# EAGLE design Jubeat Controller_c (EAGLE 6.2)
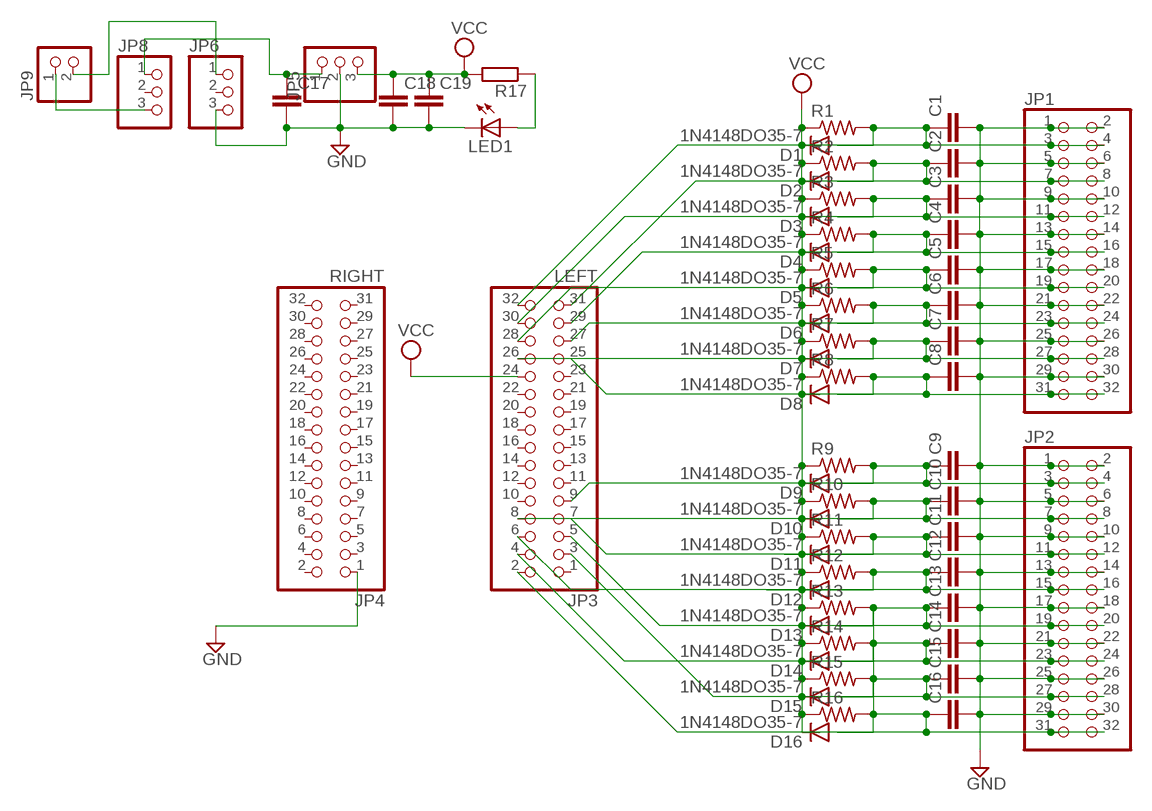
[diagram p0: schematic, sheet 1]

## Parts
C1  C-EU050-025X075  [C050-025X075]
C2  C-EU050-025X075  [C050-025X075]
C3  C-EU050-025X075  [C050-025X075]
C4  C-EU050-025X075  [C050-025X075]
C5  C-EU050-025X075  [C050-025X075]
C6  C-EU050-025X075  [C050-025X075]
C7  C-EU050-025X075  [C050-025X075]
C8  C-EU050-025X075  [C050-025X075]
C9  C-EU050-025X075  [C050-025X075]
C10  C-EU050-025X075  [C050-025X075]
C11  C-EU050-025X075  [C050-025X075]
C12  C-EU050-025X075  [C050-025X075]
C13  C-EU050-025X075  [C050-025X075]
C14  C-EU050-025X075  [C050-025X075]
C15  C-EU050-025X075  [C050-025X075]
C16  C-EU050-025X075  [C050-025X075]
C17  C-EU050-025X075  [C050-025X075]
C18  C-EU050-025X075  [C050-025X075]
C19  C-EU050-025X075  [C050-025X075]
D1  1N4148DO35-7  [DO35-7]
D2  1N4148DO35-7  [DO35-7]
D3  1N4148DO35-7  [DO35-7]
D4  1N4148DO35-7  [DO35-7]
D5  1N4148DO35-7  [DO35-7]
D6  1N4148DO35-7  [DO35-7]
D7  1N4148DO35-7  [DO35-7]
D8  1N4148DO35-7  [DO35-7]
D9  1N4148DO35-7  [DO35-7]
D10  1N4148DO35-7  [DO35-7]
D11  1N4148DO35-7  [DO35-7]
D12  1N4148DO35-7  [DO35-7]
D13  1N4148DO35-7  [DO35-7]
D14  1N4148DO35-7  [DO35-7]
D15  1N4148DO35-7  [DO35-7]
D16  1N4148DO35-7  [DO35-7]
JP1  PINHD-2X16  [2X16]
JP2  PINHD-2X16  [2X16]
JP3  LEFT  PINHD-2X16  [2X16]
JP4  RIGHT  PINHD-2X16  [2X16]
JP5  PINHD-1X3  [1X03]
JP6  PINHD-1X3  [1X03]
JP8  PINHD-1X3  [1X03]
JP9  PINHD-1X2  [1X02]
LED1  LED5MM  [LED5MM]
R1  R-US_0207/7  [0207/7]
R2  R-US_0207/7  [0207/7]
R3  R-US_0207/7  [0207/7]
R4  R-US_0207/7  [0207/7]
R5  R-US_0207/7  [0207/7]
R6  R-US_0207/7  [0207/7]
R7  R-US_0207/7  [0207/7]
R8  R-US_0207/7  [0207/7]
R9  R-US_0207/7  [0207/7]
R10  R-US_0207/7  [0207/7]
R11  R-US_0207/7  [0207/7]
R12  R-US_0207/7  [0207/7]
R13  R-US_0207/7  [0207/7]
R14  R-US_0207/7  [0207/7]
R15  R-US_0207/7  [0207/7]
R16  R-US_0207/7  [0207/7]
R17  R-EU_0207/7  [0207/7]

## Nets
GND: C1.2 C2.2 C3.2 C4.2 C5.2 C6.2 C7.2 C8.2 C9.2 C10.2 C11.2 C12.2 C13.2 C14.2 C15.2 C16.2 C17.2 C18.2 C19.2 JP1.1 JP1.2 JP1.5 JP1.6 JP1.9 JP1.10 JP1.13 JP1.14 JP1.17 JP1.18 JP1.21 JP1.22 JP1.25 JP1.26 JP1.29 JP1.30 JP2.1 JP2.2 JP2.5 JP2.6 JP2.9 JP2.10 JP2.13 JP2.14 JP2.17 JP2.18 JP2.21 JP2.22 JP2.25 JP2.26 JP2.29 JP2.30 JP4.1 JP5.2 JP6.3 LED1.K(C)
N$1: C17.1 JP5.1 JP8.1
N$2: C2.1 D2.A JP1.7 JP1.8 JP3.31 R2.2
N$5: JP6.1 JP9.2
N$6: C6.1 D6.A JP1.23 JP1.24 JP3.27 R6.2
N$7: LED1.A R17.1
N$8: C8.1 D8.A JP1.31 JP1.32 JP3.25 R8.2
N$9: C9.1 D9.A JP2.3 JP2.4 JP3.9 R9.2
N$10: C10.1 D10.A JP2.7 JP2.8 JP3.8 R10.2
N$11: C11.1 D11.A JP2.11 JP2.12 JP3.7 R11.2
N$12: C12.1 D12.A JP2.15 JP2.16 JP3.6 R12.2
N$13: C13.1 D13.A JP2.19 JP2.20 JP3.5 R13.2
N$14: C14.1 D14.A JP2.23 JP2.24 JP3.4 R14.2
N$15: C15.1 D15.A JP2.27 JP2.28 JP3.3 R15.2
N$16: C16.1 D16.A JP2.31 JP2.32 JP3.2 R16.2
N$18: C7.1 D7.A JP1.27 JP1.28 JP3.26 R7.2
N$19: JP8.3 JP9.1
N$21: C5.1 D5.A JP1.19 JP1.20 JP3.28 R5.2
N$23: C3.1 D3.A JP1.11 JP1.12 JP3.30 R3.2
N$24: C1.1 D1.A JP1.3 JP1.4 JP3.32 R1.2
N$26: C4.1 D4.A JP1.15 JP1.16 JP3.29 R4.2
VCC: C18.1 C19.1 D1.C D2.C D3.C D4.C D5.C D6.C D7.C D8.C D9.C D10.C D11.C D12.C D13.C D14.C D15.C D16.C JP3.24 JP5.3 R1.1 R2.1 R3.1 R4.1 R5.1 R6.1 R7.1 R8.1 R9.1 R10.1 R11.1 R12.1 R13.1 R14.1 R15.1 R16.1 R17.2
Unconnected: JP3.1 JP3.10 JP3.11 JP3.12 JP3.13 JP3.14 JP3.15 JP3.16 JP3.17 JP3.18 JP3.19 JP3.20 JP3.21 JP3.22 JP3.23 JP4.2 JP4.3 JP4.4 JP4.5 JP4.6 JP4.7 JP4.8 JP4.9 JP4.10 JP4.11 JP4.12 JP4.13 JP4.14 JP4.15 JP4.16 JP4.17 JP4.18 JP4.19 JP4.20 JP4.21 JP4.22 JP4.23 JP4.24 JP4.25 JP4.26 JP4.27 JP4.28 JP4.29 JP4.30 JP4.31 JP4.32 JP6.2 JP8.2

## Library data of the parts
C1-C16 = resistor:C-EU: CAPACITOR, European symbol
C17-C19 = rcl:C-EU: CAPACITOR, European symbol
D1-D16 = diode:1N4148: DIODE high speed (Philips)
JP1-JP4 = pinhead:PINHD-2X16: PIN HEADER
JP5 JP6 JP8 = pinhead:PINHD-1X3: PIN HEADER
JP9 = pinhead:PINHD-1X2: PIN HEADER
LED1 = led:LED: LED OSRAM: - CHIPLED LG R971, LG N971, LY N971, LG Q971, LY Q971, LO R971, LY R971 LH N974, LH R974 LS Q976, LO Q976, LY Q976 LO Q996 - Hyper CHIPLED LW Q18S LB Q993, LB Q99A, LB R99A - SideLED LS A670, LO A670, LY A670, LG A670, LP A670 LB A673, LV A673, LT A673, LW A673 LH A674 LY A675 LS A676, LA A676, LO A676, LY A676, LW A676 LS A679, LY A679, LG A679 - Hyper Micro SIDELED® LS Y876, LA Y876, LO Y876, LY Y876 LT Y87S - SmartLED LW L88C, LW L88S LB L89C, LB L89S, LG L890 LS L89K, LO L89K, LY L89K LS L896, LA L896, LO L896, LY L896 - TOPLED LS T670, LO T670, LY T670, LG T670, LP T670 LSG T670, LSP T670, LSY T670, LOP T670, LYG T670 LG T671, LOG T671, LSG T671 LB T673, LV T673, LT T673, LW T673 LH T674 LS T676, LA T676, LO T676, LY T676, LB T676, LH T676, LSB T676, LW T676 LB T67C, LV T67C, LT T67C, LS T67K, LO T67K, LY T67K, LW E67C LS E67B, LA E67B, LO E67B, LY E67B, LB E67C, LV E67C, LT E67C LW T67C LS T679, LY T679, LG T679 LS T770, LO T770, LY T770, LG T770, LP T770 LB T773, LV T773, LT T773, LW T773 LH T774 LS E675, LA E675, LY E675, LS T675 LS T776, LA T776, LO T776, LY T776, LB T776 LHGB T686 LT T68C, LB T68C - Hyper Mini TOPLED® LB M676 - Mini TOPLED Santana® LG M470 LS M47K, LO M47K, LY M47K Source: http://www.osram.convergy.de LUXEON: - LUMILED® LXK2-PW12-R00, LXK2-PW12-S00, LXK2-PW14-U00, LXK2-PW14-V00 LXK2-PM12-R00, LXK2-PM12-S00, LXK2-PM14-U00 LXK2-PE12-Q00, LXK2-PE12-R00, LXK2-PE12-S00, LXK2-PE14-T00, LXK2-PE14-U00 LXK2-PB12-K00, LXK2-PB12-L00, LXK2-PB12-M00, LXK2-PB14-N00, LXK2-PB14-P00, LXK2-PB14-Q00 LXK2-PR12-L00, LXK2-PR12-M00, LXK2-PR14-Q00, LXK2-PR14-R00 LXK2-PD12-Q00, LXK2-PD12-R00, LXK2-PD12-S00 LXK2-PH12-R00, LXK2-PH12-S00 LXK2-PL12-P00, LXK2-PL12-Q00, LXK2-PL12-R00 Source: www.luxeon.com KINGBRIGHT: KA-3528ASYC Source: www.kingbright.com
R1-R16 = resistor:R-US_: RESISTOR, American symbol
R17 = rcl:R-EU_: RESISTOR, European symbol

## Board
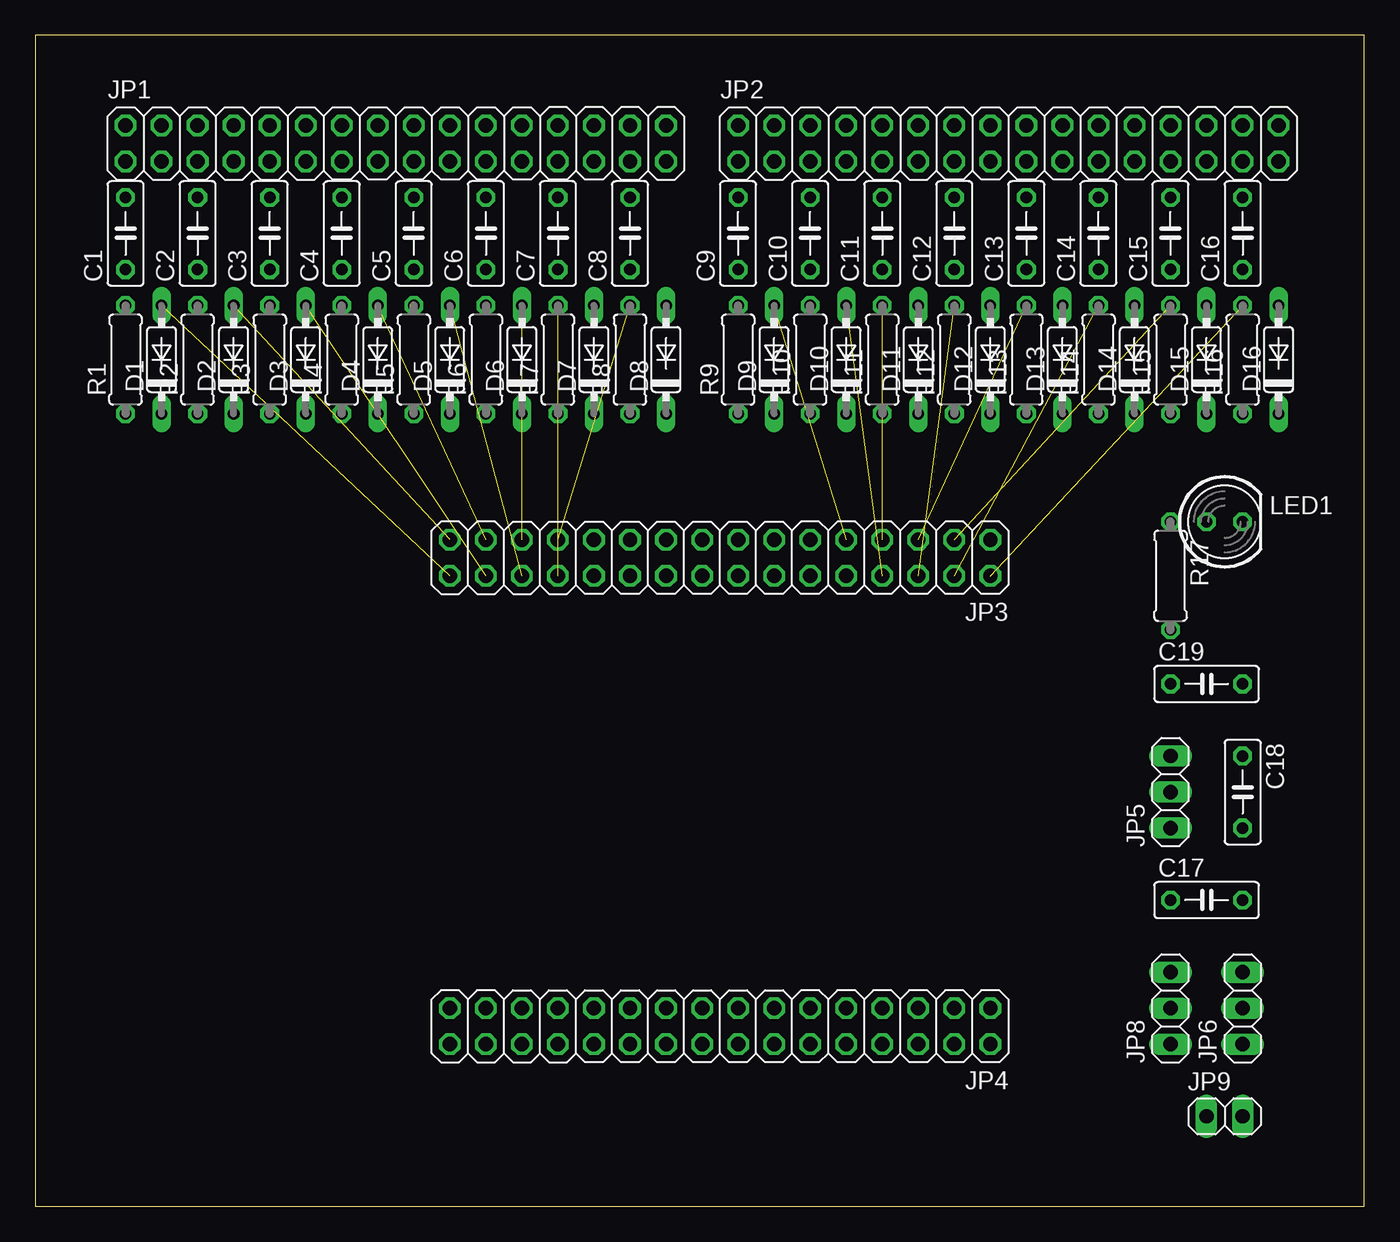
[diagram p1: board, top side]
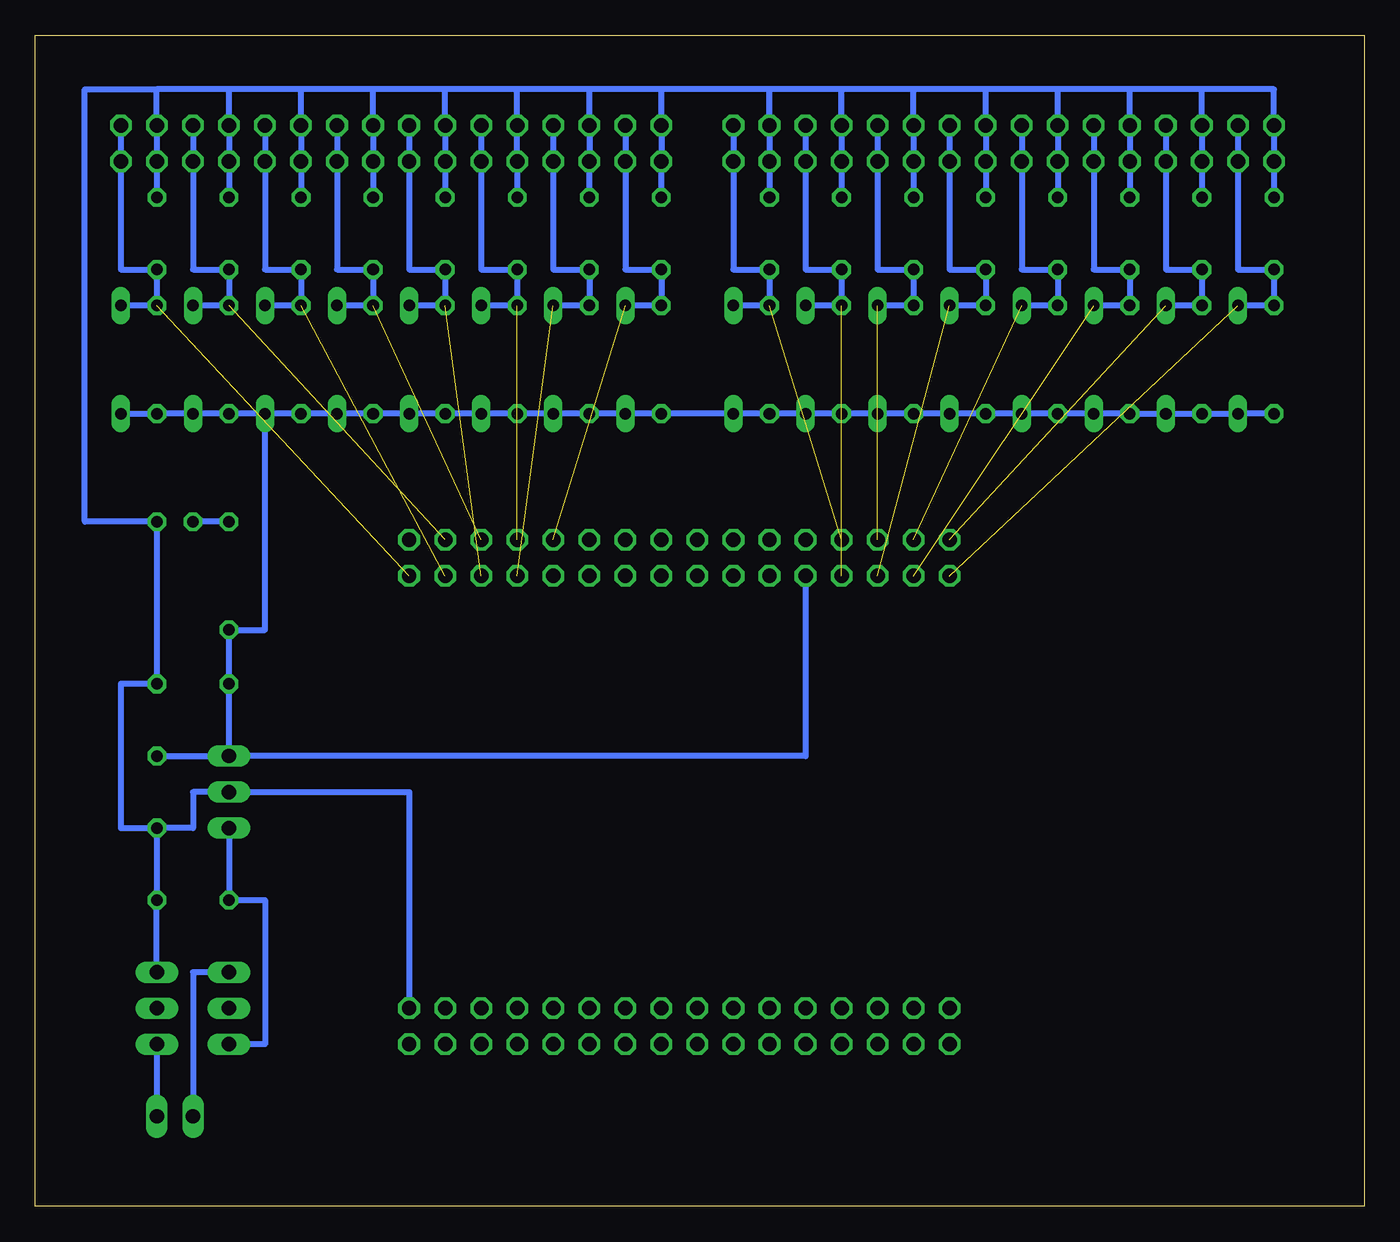
[diagram p2: board, bottom side, seen from below]

Size 93.65 x 82.54 mm. Coordinates in mm from the lower left corner, seen from the top.
Outline: 0,0 93.65,0 93.65,82.54 0,82.54 0,0
Copper layers (1*16): Top 0.035mm / dielectric 1.5mm / Bottom 0.035mm
Design rules: minimum track width 10mil, minimum drill 24mil, track to track 8mil, track to pad 8mil, pad to pad 8mil, via to via 8mil, smd to smd 8mil, copper to edge 40mil, drill to drill 8mil, minimum pad ring 10mil, minimum via ring 8mil, stop-mask expansion 4mil, vias tented up to drill 0mil, thermal gap 10mil

### Footprints (pad centres in the part's own frame; a part is rotated, then mirrored left to right if it is on the bottom)
C050-025X075 = drill 0.813 octagon: 1 -2.54,0; 2 2.54,0
DO35-7 = drill 0.813 long: A 3.81,0; C -3.81,0
2X16 = drill 1.016 octagon: 1 -19.05,-1.27; 2 -19.05,1.27; 3 -16.51,-1.27; 4 -16.51,1.27; 5 -13.97,-1.27; 6 -13.97,1.27; 7 -11.43,-1.27; 8 -11.43,1.27; 9 -8.89,-1.27; 10 -8.89,1.27; 11 -6.35,-1.27; 12 -6.35,1.27; 13 -3.81,-1.27; 14 -3.81,1.27; 15 -1.27,-1.27; 16 -1.27,1.27; 17 1.27,-1.27; 18 1.27,1.27; 19 3.81,-1.27; 20 3.81,1.27; 21 6.35,-1.27; 22 6.35,1.27; 23 8.89,-1.27; 24 8.89,1.27; 25 11.43,-1.27; 26 11.43,1.27; 27 13.97,-1.27; 28 13.97,1.27; 29 16.51,-1.27; 30 16.51,1.27; 31 19.05,-1.27; 32 19.05,1.27
1X03 = drill 1.016 long: 1 -2.54,0; 2 0,0; 3 2.54,0
1X02 = drill 1.016 long: 1 -1.27,0; 2 1.27,0
LED5MM = drill 0.813 octagon: A -1.27,0; K 1.27,0
0207/7 = drill 0.813 octagon: 1 -3.81,0; 2 3.81,0

### Placement (x,y rotation side)
C1  6.35,68.58 90 top
C2  11.43,68.58 90 top
C3  16.51,68.58 90 top
C4  21.59,68.58 90 top
C5  26.67,68.58 90 top
C6  31.75,68.58 90 top
C7  36.83,68.58 90 top
C8  41.91,68.58 90 top
C9  49.53,68.58 90 top
C10  54.61,68.58 90 top
C11  59.69,68.58 90 top
C12  64.77,68.58 90 top
C13  69.85,68.58 90 top
C14  74.93,68.58 90 top
C15  80.01,68.58 90 top
C16  85.09,68.58 90 top
C17  82.55,21.59 0 top
C18  85.09,29.21 270 top
C19  82.55,36.83 0 top
D1  8.89,59.69 90 top
D2  13.97,59.69 90 top
D3  19.05,59.69 90 top
D4  24.13,59.69 90 top
D5  29.21,59.69 90 top
D6  34.29,59.69 90 top
D7  39.37,59.69 90 top
D8  44.45,59.69 90 top
D9  52.07,59.69 90 top
D10  57.15,59.69 90 top
D11  62.23,59.69 90 top
D12  67.31,59.69 90 top
D13  72.39,59.69 90 top
D14  77.47,59.69 90 top
D15  82.55,59.69 90 top
D16  87.63,59.69 90 top
JP1  25.4,74.93 0 top
JP2  68.58,74.93 0 top
JP3  48.26,45.72 180 top
JP4  48.26,12.7 180 top
JP5  80.01,29.21 90 top
JP6  85.09,13.97 90 top
JP8  80.01,13.97 90 top
JP9  83.82,6.35 0 top
LED1  83.82,48.26 0 top
R1  6.35,59.69 90 top
R2  11.43,59.69 90 top
R3  16.51,59.69 90 top
R4  21.59,59.69 90 top
R5  26.67,59.69 90 top
R6  31.75,59.69 90 top
R7  36.83,59.69 90 top
R8  41.91,59.69 90 top
R9  49.53,59.69 90 top
R10  54.61,59.69 90 top
R11  59.69,59.69 90 top
R12  64.77,59.69 90 top
R13  69.85,59.69 90 top
R14  74.93,59.69 90 top
R15  80.01,59.69 90 top
R16  85.09,59.69 90 top
R17  80.01,44.45 270 top

### Tracks (layer width: path | path; a pad name or v marks a point on that pad's centre or on a via)
GND
  Bottom 0.406: JP6.3 C17.2 C18.2 | JP4.1 67.31,29.21 JP5.2 82.55,29.21 82.55,26.67 C18.2 | C18.2 87.63,26.67 87.63,36.83 C19.2 LED1.K 90.17,48.26 90.17,78.74 85.09,78.74 | C9.2 JP2.1 JP2.2 49.53,78.74 | C10.2 JP2.5 JP2.6 54.61,78.74 | C11.2 JP2.9 JP2.10 59.69,78.74 | C1.2 JP1.1 JP1.2 6.35,78.74 11.43,78.74 | C2.2 JP1.5 JP1.6 11.43,78.74 | C3.2 JP1.9 JP1.10 16.51,78.74 | C4.2 JP1.13 JP1.14 21.59,78.74 | C5.2 JP1.17 JP1.18 26.67,78.74 | C6.2 JP1.21 JP1.22 31.75,78.74 | C7.2 JP1.25 JP1.26 36.83,78.74 | C8.2 JP1.29 JP1.30 41.91,78.74 | C12.2 JP2.13 JP2.14 64.77,78.74 | C13.2 JP2.17 JP2.18 69.85,78.74 | C14.2 JP2.21 JP2.22 74.93,78.74 | C15.2 JP2.25 JP2.26 80.01,78.74 | C16.2 JP2.29 JP2.30 85.09,78.74 | 11.43,78.74 16.51,78.74 | 16.51,78.74 21.59,78.74 | 21.59,78.74 26.67,78.74 | 26.67,78.74 31.75,78.74 | 31.75,78.74 36.83,78.74 | 36.83,78.74 41.91,78.74 | 41.91,78.74 49.53,78.74 | 49.53,78.74 54.61,78.74 | 54.61,78.74 59.69,78.74 | 59.69,78.74 64.77,78.74 | 64.77,78.74 69.85,78.74 | 69.85,78.74 74.93,78.74 | 74.93,78.74 80.01,78.74 | 80.01,78.74 85.09,78.74
N$1
  Bottom 0.406: JP5.1 C17.1 77.47,21.59 77.47,11.43 JP8.1
N$2  (1 unrouted)
  Bottom 0.406: JP1.8 JP1.7 13.97,66.04 C2.1 R2.2 D2.A
N$5
  Bottom 0.406: JP6.1 JP9.2
N$6  (1 unrouted)
  Bottom 0.406: JP1.24 JP1.23 34.29,66.04 C6.1 R6.2 D6.A
N$7
  Bottom 0.406: R17.1 LED1.A
N$8  (1 unrouted)
  Bottom 0.406: JP1.32 JP1.31 44.45,66.04 C8.1 R8.2 D8.A
N$9  (1 unrouted)
  Bottom 0.406: JP2.4 JP2.3 52.07,66.04 C9.1 R9.2 D9.A
N$10  (1 unrouted)
  Bottom 0.406: JP2.8 JP2.7 57.15,66.04 C10.1 R10.2 D10.A
N$11  (1 unrouted)
  Bottom 0.406: JP2.12 JP2.11 62.23,66.04 C11.1 R11.2 D11.A
N$12  (1 unrouted)
  Bottom 0.406: JP2.16 JP2.15 67.31,66.04 C12.1 R12.2 D12.A
N$13  (1 unrouted)
  Bottom 0.406: JP2.20 JP2.19 72.39,66.04 C13.1 R13.2 D13.A
N$14  (1 unrouted)
  Bottom 0.406: JP2.24 JP2.23 77.47,66.04 C14.1 R14.2 D14.A
N$15  (1 unrouted)
  Bottom 0.406: JP2.28 JP2.27 82.55,66.04 C15.1 R15.2 D15.A
N$16  (1 unrouted)
  Bottom 0.406: JP2.32 JP2.31 87.63,66.04 C16.1 R16.2 D16.A
N$18  (1 unrouted)
  Bottom 0.406: JP1.28 JP1.27 39.37,66.04 C7.1 R7.2 D7.A
N$19
  Bottom 0.406: JP8.3 82.55,16.51 JP9.1
N$21  (1 unrouted)
  Bottom 0.406: JP1.20 JP1.19 29.21,66.04 C5.1 R5.2 D5.A
N$23  (1 unrouted)
  Bottom 0.406: JP1.12 JP1.11 19.05,66.04 C3.1 R3.2 D3.A
N$24  (1 unrouted)
  Bottom 0.406: JP1.4 JP1.3 8.89,66.04 C1.1 R1.2 D1.A
N$26  (1 unrouted)
  Bottom 0.406: JP1.16 JP1.15 24.13,66.04 C4.1 R4.2 D4.A
VCC
  Bottom 0.406: C18.1 JP5.3 | JP5.3 C19.1 R17.2 77.47,40.64 D14.C | D16.C R16.1 D15.C R15.1 D14.C | D14.C R14.1 D13.C R13.1 D12.C R12.1 D11.C R11.1 D10.C R10.1 D9.C R9.1 D8.C R8.1 D7.C R7.1 D6.C R6.1 D5.C R5.1 D4.C R4.1 D3.C R3.1 D2.C R2.1 D1.C R1.1 | JP3.24 39.37,31.75 JP5.3